# EAGLE board LAUNCHXL-F28069_B_1400922 (EAGLE 6.5.0), part 1 of 2
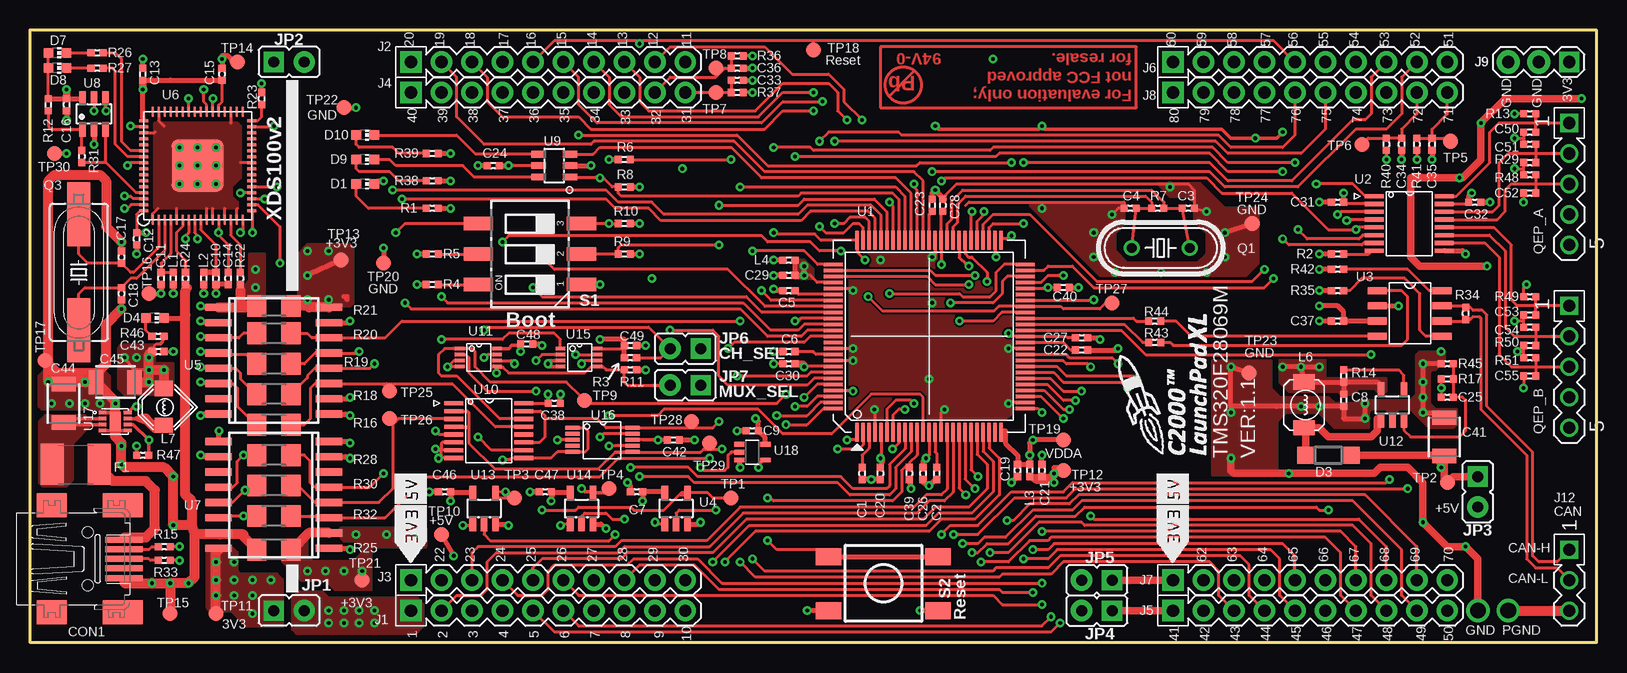
[diagram p7: board, top side]
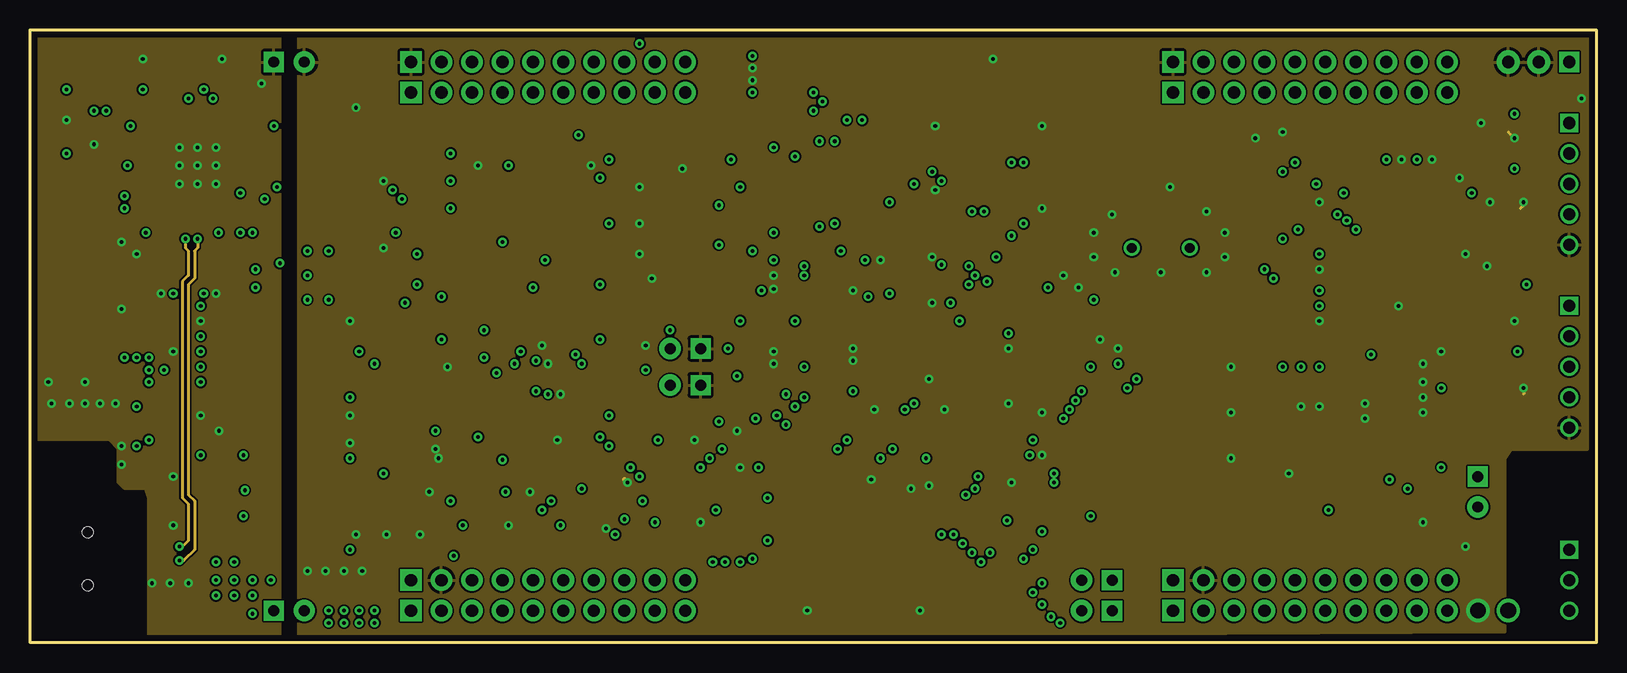
[diagram p8: board, inner layer GND]
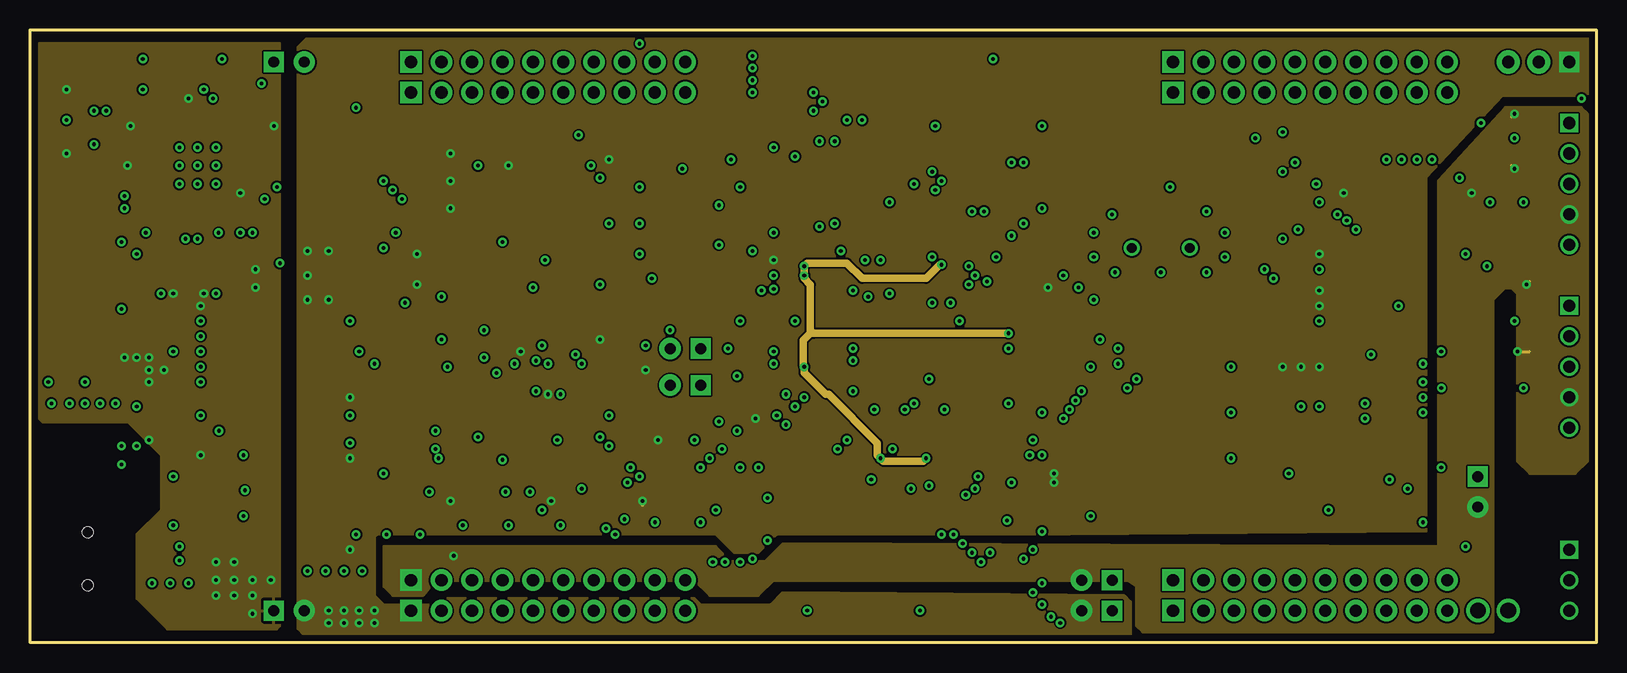
[diagram p9: board, inner layer VDD]
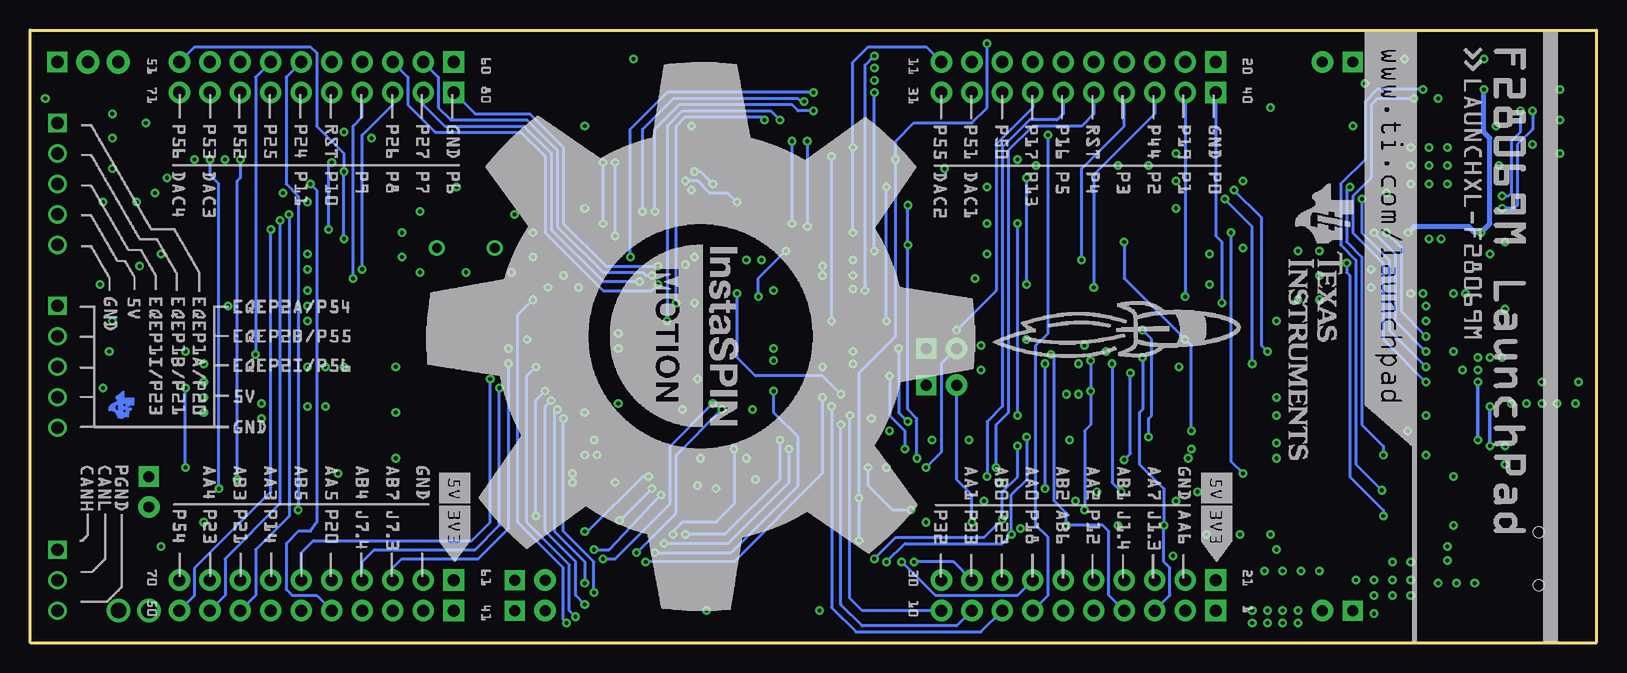
[diagram p10: board, bottom side, seen from below]

Size 130.56 x 51.05 mm. Coordinates in mm from the lower left corner, seen from the top.
Outline: 130.56,0 0,0 0,51.05 130.56,51.05 130.56,0
Copper layers (1*2+3*16): Top 0.035mm / dielectric 0.3mm / GND 0.035mm / dielectric 0.8mm / VDD 0.035mm / dielectric 0.3mm / Bottom 0.035mm
Design rules "default": minimum track width 8mil, minimum drill 10mil, track to track 6mil, track to pad 6mil, pad to pad 5mil, via to via 8mil, smd to smd 5mil, copper to edge 20mil, drill to drill 10mil, minimum pad ring 10mil, minimum via ring 8mil, stop-mask expansion 4mil, vias tented up to drill 0mil, thermal gap 10mil
Net classes: 0 default: width 0.152 mm, drill 0.305 mm, clearance 0.152 mm
bRestrict: area 21.8,38.7 to 24.4,41.3

## Footprints (pad centres in the part's own frame; a part is rotated, then mirrored left to right if it is on the bottom)
C0402 = smd 0.6 x 0.6: 1 -0.5,0; 2 0.5,0
SPARKFUN_1210 = smd 1.2 x 2: 1 -1.6,0; 2 1.6,0
32005-201 = smd 3.1 x 0.5: 1 3,1.6; 2 3,0.8; 3 3,0; 4 3,-0.8; 5 3,-1.6 | smd 2.5 x 2: M1 -3,-4.45; M2 -3,4.45 | smd 3.3 x 2: M3 2.9,4.45; M4 2.9,-4.45 | hole 0.9: 0,2.2; 0,-2.2
CHIP-LED0603 = smd 0.8 x 0.8: A 0,-0.75; C 0,0.75
SOD123 = smd 1.4 x 1.4: A 1.9,0; C -1.9,0
L1812 = smd 1.9 x 3.4: 1 -1.95,0; 2 1.95,0
MA10-1 = drill 1.016 pad 1.778 square: 1 -11.43,0 | drill 1.016 pad 1.778: 2 -8.89,0; 3 -6.35,0; 4 -3.81,0; 5 -1.27,0; 6 1.27,0; 7 3.81,0; 8 6.35,0; 9 8.89,0; 10 11.43,0
CON-LSTB_MA03-1 = drill 1.016 pad 1.676 square: 1 -2.54,0 | drill 1.016 pad 1.93: 2 0,0; 3 2.54,0
MA03-1 = drill 1.016 square: 1 -2.54,0 | drill 1.016: 2 0,0; 3 2.54,0
JP1 = drill 0.914 pad 1.676 square: 1 0,-1.27 | drill 0.914 pad 1.778: 2 0,1.27
R0402 = smd 0.6 x 0.6: 1 -0.5,0; 2 0.5,0
INDUCT-3_7*3_5 = smd 1.27 x 1.8: P$1 0,0; P$2 3.81,0
INDUCT-3.2*3.2 = smd 1.5 x 1.27 rotated 135: P$1 1.019,1.189 | smd 1.5 x 1.27 rotated 315: P$2 -1.137,-0.966
HC49/S = drill 0.813: 1 -2.413,0; 2 2.413,0
HC49UP = smd 5.334 x 1.93: 1 -4.826,0; 2 4.826,0
MA05-1 = drill 1.016 square: 1 -5.08,0 | drill 1.016: 2 -2.54,0; 3 0,0; 4 2.54,0; 5 5.08,0
R1206 = smd 1.6 x 1.803: 1 -1.422,0; 2 1.422,0
CTS-219-03 = smd 1.13 x 2.44: 1 -2.54,-4.3; 2 0,-4.3; 3 2.54,-4.3; 4 2.54,4.3; 5 0,4.3; 6 -2.54,4.3
FSMJSMA = smd 1.397 x 2.108: P$1 0,0; P$2 0,-9.119; P$3 4.496,0; P$4 4.496,-9.119
TESTPAD_B1,27 = smd 1.27 x 1.27: TP 0,0
PQFP100 = smd 1.6 x 0.3: 1 -8,6; 2 -8,5.5; 3 -8,5; 4 -8,4.5; 5 -8,4; 6 -8,3.5; 7 -8,3; 8 -8,2.5; 9 -8,2; 10 -8,1.5; 11 -8,1; 12 -8,0.5; 13 -8,0; 14 -8,-0.5; 15 -8,-1; 16 -8,-1.5; 17 -8,-2; 18 -8,-2.5; 19 -8,-3; 20 -8,-3.5; 21 -8,-4; 22 -8,-4.5; 23 -8,-5; 24 -8,-5.5; 25 -8,-6; 51 8,-6; 52 8,-5.5; 53 8,-5; 54 8,-4.5; 55 8,-4; 56 8,-3.5; 57 8,-3; 58 8,-2.5; 59 8,-2; 60 8,-1.5; 61 8,-1; 62 8,-0.5; 63 8,0; 64 8,0.5; 65 8,1; 66 8,1.5; 67 8,2; 68 8,2.5; 69 8,3; 70 8,3.5; 71 8,4; 72 8,4.5; 73 8,5; 74 8,5.5; 75 8,6 | smd 0.3 x 1.6: 26 -6,-8; 27 -5.5,-8; 28 -5,-8; 29 -4.5,-8; 30 -4,-8; 31 -3.5,-8; 32 -3,-8; 33 -2.5,-8; 34 -2,-8; 35 -1.5,-8; 36 -1,-8; 37 -0.5,-8; 38 0,-8; 39 0.5,-8; 40 1,-8; 41 1.5,-8; 42 2,-8; 43 2.5,-8; 44 3,-8; 45 3.5,-8; 46 4,-8; 47 4.5,-8; 48 5,-8; 49 5.5,-8; 50 6,-8; 76 6,8; 77 5.5,8; 78 5,8; 79 4.5,8; 80 4,8; 81 3.5,8; 82 3,8; 83 2.5,8; 84 2,8; 85 1.5,8; 86 1,8; 87 0.5,8; 88 0,8; 89 -0.5,8; 90 -1,8; 91 -1.5,8; 92 -2,8; 93 -2.5,8; 94 -3,8; 95 -3.5,8; 96 -4,8; 97 -4.5,8; 98 -5,8; 99 -5.5,8; 100 -6,8
TSSOP16-PW = smd 0.35 x 1.6: P$1 0,0; P$2 0.65,0; P$3 1.3,0; P$4 1.95,0; P$5 2.6,0; P$6 3.25,0; P$7 3.9,0; P$8 4.55,0; P$9 4.55,5.85; P$10 3.9,5.85; P$11 3.25,5.85; P$12 2.6,5.85; P$13 1.95,5.85; P$14 1.3,5.85; P$15 0.65,5.85; P$16 0,5.85
SOIC8-PDSO = smd 0.6 x 1.6: P$1 0,0; P$2 1.27,0; P$3 2.54,0; P$4 3.81,0; P$5 3.81,5.4; P$6 2.54,5.4; P$7 1.27,5.4; P$8 0,5.4
SOT23-5-DBV = smd 0.55 x 1.2: 1 -1.204,-0.919; 2 -0.254,-0.919; 3 0.696,-0.919; 4 0.696,1.681; 5 -1.204,1.681
SO-16DW = smd 0.6 x 2.2: 1 -4.445,-4.6; 2 -3.175,-4.6; 3 -1.905,-4.6; 4 -0.635,-4.6; 5 0.635,-4.6; 6 1.905,-4.6; 7 3.175,-4.6; 8 4.445,-4.6; 9 4.445,4.6; 10 3.175,4.6; 11 1.905,4.6; 12 0.635,4.6; 13 -0.635,4.6; 14 -1.905,4.6; 15 -3.175,4.6; 16 -4.445,4.6
QFN64 = smd 0.8 x 0.25: P$1 -4.5,3.75; P$2 -4.5,3.25; P$3 -4.5,2.75; P$4 -4.5,2.25; P$5 -4.5,1.75; P$6 -4.5,1.25; P$7 -4.5,0.75; P$8 -4.5,0.25; P$9 -4.5,-0.25; P$10 -4.5,-0.75; P$11 -4.5,-1.25; P$12 -4.5,-1.75; P$13 -4.5,-2.25; P$14 -4.5,-2.75; P$15 -4.5,-3.25; P$16 -4.5,-3.75; P$33 4.5,-3.75; P$34 4.5,-3.25; P$35 4.5,-2.75; P$36 4.5,-2.25; P$37 4.5,-1.75; P$38 4.5,-1.25; P$39 4.5,-0.75; P$40 4.5,-0.25; P$41 4.5,0.25; P$42 4.5,0.75; P$43 4.5,1.25; P$44 4.5,1.75; P$45 4.5,2.25; P$46 4.5,2.75; P$47 4.5,3.25; P$48 4.5,3.75 | smd 0.25 x 0.8: P$17 -3.75,-4.5; P$18 -3.25,-4.5; P$19 -2.75,-4.5; P$20 -2.25,-4.5; P$21 -1.75,-4.5; P$22 -1.25,-4.5; P$23 -0.75,-4.5; P$24 -0.25,-4.5; P$25 0.25,-4.5; P$26 0.75,-4.5; P$27 1.25,-4.5; P$28 1.75,-4.5; P$29 2.25,-4.5; P$30 2.75,-4.5; P$31 3.25,-4.5; P$32 3.75,-4.5; P$49 3.75,4.5; P$50 3.25,4.5; P$51 2.75,4.5; P$52 2.25,4.5; P$53 1.75,4.5; P$54 1.25,4.5; P$55 0.75,4.5; P$56 0.25,4.5; P$57 -0.25,4.5; P$58 -0.75,4.5; P$59 -1.25,4.5; P$60 -1.75,4.5; P$61 -2.25,4.5; P$62 -2.75,4.5; P$63 -3.25,4.5; P$64 -3.75,4.5 | smd 4.35 x 4.35: TH 0,0
SOT23-6 = smd 0.55 x 1.2: 1 -0.95,-1.3; 2 0,-1.3; 3 0.95,-1.3; 4 0.95,1.3; 5 0,1.3; 6 -0.95,1.3
SOT23-6-DBV = smd 0.55 x 1.2: 1 -0.95,-1.3; 2 0,-1.3; 3 0.95,-1.3; 4 0.95,1.3; 5 0,1.3; 6 -0.95,1.3
TI-DCU8 = smd 0.3 x 0.8: P$1 0,0; P$2 0.5,0; P$3 1,0; P$4 1.5,0; P$5 1.5,3.1; P$6 1,3.1; P$7 0.5,3.1; P$8 0,3.1
TI-DGS10 = smd 0.3 x 1.2: P$1 0,0; P$2 0.5,0; P$3 1,0; P$4 1.5,0; P$5 2,0; P$6 2,5; P$7 1.5,5; P$8 1,5; P$9 0.5,5; P$10 0,5
TI_DSG8 = smd 0.27 x 0.635: P$1 0,-0.05; P$2 0.5,-0.05; P$3 1,-0.05; P$4 1.5,-0.05; P$5 1.5,2.05; P$6 1,2.05; P$7 0.5,2.05; P$8 0,2.05 | smd 1.6 x 0.9: P$9 0.75,1
74XX-LITTLE-DE_SC70-5 = smd 0.4 x 0.85: 1 -0.65,-1.1; 2 0,-1.1; 3 0.65,-1.1; 4 0.65,1.1; 5 -0.65,1.1

## Placement (x,y rotation side)
C1  2.2u  [C0402]  69.34,14.1 270 top
C2  2.2u  [C0402]  75.56,14.1 270 top
C3  36p  [C0402]  96.52,36.2 0 top
C4  36p  [C0402]  91.69,36.2 180 top
C5  2.2u  [C0402]  63.25,29.34 180 top
C6  2.2u  [C0402]  63.25,24.26 180 top
C7  0.1u  [C0402]  50.55,12.57 180 top
C8  4.7u  [C0402]  109.47,20.19 270 top
C9  0.1u  [C0402]  60.2,17.65 180 top
C10  4.7u  [C0402]  15.49,30.35 270 top
C11  4.7u  [C0402]  10.92,30.35 270 top
C12  0.1u  [C0402]  8.89,33.66 270 top
C13  0.1u  [C0402]  9.4,47.37 90 top
C14  0.1u  [C0402]  16.51,30.35 270 top
C15  3.3u  [C0402]  16,47.37 90 top
C16  0.1u  [C0402]  3.05,44.83 270 top
C17  36p  [C0402]  7.62,32.13 90 top
C18  36p  [C0402]  7.62,29.08 270 top
C19  2.2u  [C0402]  82.3,14.35 270 top
C20  2.2u  [C0402]  70.87,14.1 270 top
C21  2.2u  [C0402]  84.33,14.35 90 top
C22  2.2u  [C0402]  87.63,24.38 0 top
C23  2.2u  [C0402]  75.18,36.45 90 top
C24  0.1u  [C0402]  38.61,39.75 180 top
C25  820p  [C0402]  118.11,20.45 0 top
C26  2.2u  [C0402]  74.42,14.1 270 top
C27  2.2u  [C0402]  87.63,25.4 0 top
C28  2.2u  [C0402]  76.07,36.45 90 top
C29  2.2u  [C0402]  63.25,30.61 180 top
C30  2.2u  [C0402]  63.25,23.24 180 top
C31  0.1u  [C0402]  108.97,36.7 180 top
C32  0.1u  [C0402]  120.4,36.7 0 top
C33  0.1u  [C0402]  58.93,46.86 0 top
C34  0.1u  [C0402]  114.3,41.53 270 top
C35  0.1u  [C0402]  116.84,41.53 270 top
C36  0.1u  [C0402]  58.93,47.88 0 top
C37  0.1u  [C0402]  108.97,26.8 180 top
C38  0.1u  [C0402]  43.69,19.94 0 top
C39  0.1u  [C0402]  73.28,14.1 270 top
C40  0.1u  [C0402]  86.11,29.59 0 top
C41  10uF  [SPARKFUN_1210]  117.86,17.14 270 top
C42  0.1u  [C0402]  53.59,16.89 0 top
C43  0.1u  [C0402]  10.67,24.26 0 top
C44  10uF  [SPARKFUN_1210]  2.79,19.94 270 top
C45  22uF  [SPARKFUN_1210]  7.11,21.72 0 top
C46  0.1u  [C0402]  34.54,12.57 180 top
C47  0.1u  [C0402]  42.93,12.57 180 top
C48  0.1u  [C0402]  41.4,24.89 0 top
C49  0.1u  [C0402]  50.04,24.77 0 top
C50  0.001u  [C0402]  124.97,42.55 180 top
C51  0.001u  [C0402]  124.97,41.53 180 top
C52  0.001u  [C0402]  124.97,37.47 180 top
C53  0.001u  [C0402]  124.97,27.3 180 top
C54  0.001u  [C0402]  124.97,26.29 180 top
C55  0.001u  [C0402]  124.97,22.22 180 top
CON1  UBC05V128-B0C04D  [32005-201]  4.83,6.98 0 top
D1  [CHIP-LED0603]  27.94,38.23 270 top
D3  1N5819HW-7-F  [SOD123]  108.2,15.62 180 top
D4  [CHIP-LED0603]  10.41,27.05 270 top
D7  [CHIP-LED0603]  2.29,49.15 270 top
D8  [CHIP-LED0603]  2.29,47.88 270 top
D9  [CHIP-LED0603]  27.94,40.26 270 top
D10  [CHIP-LED0603]  27.94,42.29 270 top
E$1  [IS_MOTION]  51.82,2.67 0 top
E$2  [F28069M_BACKSILK_1]  -0.25,0.13 0 top
E$3  [F28069M_BACKSILK_2]  26.42,0.13 0 top
E$4  [F28069M_BACKSILK_3]  90.55,0.25 0 top
E$5  [POWER_TAG_FRONT]  29.97,6.48 0 top
E$6  [POWER_TAG_FRONT]  93.47,6.48 0 top
E$7  [POWERTAG_BACK]  30.1,6.6 0 top
E$8  [POWERTAG_BACK]  93.6,6.6 0 top
E$9  [ROCKET_1]  27.69,21.21 0 top
F1  500mA  [L1812]  3.81,14.86 0 top
J1  [MA10-1]  43.18,2.67 0 top
J2  [MA10-1]  43.18,48.39 0 top
J3  [MA10-1]  43.18,5.21 0 top
J4  [MA10-1]  43.18,45.85 0 top
J5  [MA10-1]  106.68,2.67 0 top
J6  [MA10-1]  106.68,48.39 0 top
J7  [MA10-1]  106.68,5.21 0 top
J8  [MA10-1]  106.68,45.85 0 top
J9  [CON-LSTB_MA03-1]  125.73,48.39 180 top
J12  [MA03-1]  128.27,5.21 270 top
JP1  [JP1]  21.59,2.67 270 top
JP2  [JP1]  21.59,48.39 270 top
JP3  [JP1]  120.65,12.57 180 top
JP4  [JP1]  88.9,2.67 90 top
JP5  [JP1]  88.9,5.21 90 top
JP6  [JP1]  54.61,24.51 90 top
JP7  [JP1]  54.61,21.46 90 top
L1  BLM15AG601SN1D  [R0402]  11.94,30.35 90 top
L2  BLM15AG601SN1D  [R0402]  14.48,30.35 90 top
L3  BKP1005HS221-T  [R0402]  83.31,14.35 270 top
L4  BLM15PD600SN1D  [R0402]  63.25,31.88 180 top
L6  3.3uH  [INDUCT-3_7*3_5]  106.17,21.72 270 top
L7  2.2uH  [INDUCT-3.2*3.2]  11.25,19.61 45 top
Q1  [HC49/S]  94.23,32.89 0 top
Q3  12M  [HC49UP]  4.06,30.86 270 top
QEP_A  [MA05-1]  128.27,38.23 270 top
QEP_B  [MA05-1]  128.27,22.99 270 top
R1  820  [R0402]  33.53,36.2 0 top
R2  2.2k  [R0402]  108.97,32.39 0 top
R3  10K  [R0402]  50.04,23.75 0 top
R4  820  [R0402]  33.53,29.84 180 top
R5  820  [R0402]  33.53,32.39 180 top
R6  2.2k  [R0402]  49.53,40.26 180 top
R7  1M  [R0402]  93.98,36.2 0 top
R8  2.2k  [R0402]  49.53,37.97 180 top
R9  2.2k  [R0402]  49.53,32.39 180 top
R10  2.2k  [R0402]  49.53,34.93 180 top
R11  10K  [R0402]  50.04,22.73 180 top
R12  10K  [R0402]  1.52,44.83 270 top
R13  1K  [R0402]  124.97,44.07 0 top
R14  10K  [R0402]  109.47,22.22 90 top
R15  0R  [R0402]  11.18,8 0 top
R16  0  [R1206]  20.32,18.16 0 top
R17  30.1K  [R0402]  118.11,21.97 0 top
R18  0  [R1206]  20.32,20.7 0 top
R19  0  [R1206]  20.32,23.24 0 top
R20  0  [R1206]  20.32,25.78 0 top
R21  0  [R1206]  20.32,28.07 0 top
R22  1K  [R0402]  17.53,30.35 90 top
R23  1K  [R0402]  19.3,45.34 90 top
R24  12k  [R0402]  12.95,30.35 90 top
R25  0  [R1206]  20.32,7.75 0 top
R26  330  [R0402]  5.59,49.15 180 top
R27  330  [R0402]  5.59,47.88 180 top
R28  0  [R1206]  20.32,15.62 0 top
R29  1K  [R0402]  124.97,40.01 0 top
R30  0  [R1206]  20.32,13.08 0 top
R31  2.2k  [R0402]  4.32,40.51 270 top
R32  0  [R1206]  20.32,10.54 0 top
R33  0R  [R0402]  11.18,6.86 0 top
R34  120  [R0402]  119.63,27.43 90 top
R35  10K  [R0402]  108.97,29.34 180 top
R36  1K  [R0402]  58.93,48.9 180 top
R37  1K  [R0402]  58.93,45.85 180 top
R38  330  [R0402]  33.53,38.48 0 top
R39  330  [R0402]  33.53,40.77 0 top
R40  1K  [R0402]  113.03,41.53 90 top
R41  1K  [R0402]  115.57,41.53 90 top
R42  10K  [R0402]  108.97,31.11 180 top
R43  0R  [R0402]  93.73,25.02 180 top
R44  0R  [R0402]  93.73,26.8 180 top
R45  10K  [R0402]  118.11,23.24 180 top
R46  820  [R0402]  10.67,25.53 0 top
R47  100K  [R0402]  9.4,15.62 180 top
R48  1K  [R0402]  124.97,38.99 0 top
R49  1K  [R0402]  124.97,28.83 0 top
R50  1K  [R0402]  124.97,24.77 0 top
R51  1K  [R0402]  124.97,23.75 0 top
S1  204-3ST  [CTS-219-03]  41.66,32.39 90 top
S2  TP-1138K9-BE1125  [FSMJSMA]  66.55,2.67 90 top
TP1  TESTPAD_TPB1,27  [TESTPAD_B1,27]  58.42,12.07 0 top
TP2  TESTPAD_TPB1,27  [TESTPAD_B1,27]  118.11,13.34 0 top
TP3  TESTPAD_TPB1,27  [TESTPAD_B1,27]  40.39,12.07 0 top
TP4  TESTPAD_TPB1,27  [TESTPAD_B1,27]  48.26,12.83 0 top
TP5  TESTPAD_TPB1,27  [TESTPAD_B1,27]  118.36,41.78 0 top
TP6  TESTPAD_TPB1,27  [TESTPAD_B1,27]  111,41.53 0 top
TP7  TESTPAD_TPB1,27  [TESTPAD_B1,27]  57.15,45.85 0 top
TP8  TESTPAD_TPB1,27  [TESTPAD_B1,27]  57.15,47.88 0 top
TP9  TESTPAD_TPB1,27  [TESTPAD_B1,27]  46.23,20.19 0 top
TP10  TESTPAD_TPB1,27  [TESTPAD_B1,27]  34.29,9.02 0 top
TP11  TESTPAD_TPB1,27  [TESTPAD_B1,27]  15.49,2.41 0 top
TP12  TESTPAD_TPB1,27  [TESTPAD_B1,27]  86.11,14.35 270 top
TP13  TESTPAD_TPB1,27  [TESTPAD_B1,27]  25.91,31.88 0 top
TP14  TESTPAD_TPB1,27  [TESTPAD_B1,27]  17.27,48.39 0 top
TP15  TESTPAD_TPB1,27  [TESTPAD_B1,27]  11.68,2.41 0 top
TP16  TESTPAD_TPB1,27  [TESTPAD_B1,27]  9.91,29.08 0 top
TP17  TESTPAD_TPB1,27  [TESTPAD_B1,27]  1.27,23.49 0 top
TP18  TESTPAD_TPB1,27  [TESTPAD_B1,27]  65.28,49.4 270 top
TP19  TESTPAD_TPB1,27  [TESTPAD_B1,27]  86.11,16.89 0 top
TP20  TESTPAD_TPB1,27  [TESTPAD_B1,27]  29.46,31.62 0 top
TP21  TESTPAD_TPB1,27  [TESTPAD_B1,27]  27.69,5.21 0 top
TP22  TESTPAD_TPB1,27  [TESTPAD_B1,27]  26.16,44.58 270 top
TP23  TESTPAD_TPB1,27  [TESTPAD_B1,27]  101.6,22.48 0 top
TP24  TESTPAD_TPB1,27  [TESTPAD_B1,27]  101.85,34.93 0 top
TP25  TESTPAD_TPB1,27  [TESTPAD_B1,27]  29.97,20.95 0 top
TP26  TESTPAD_TPB1,27  [TESTPAD_B1,27]  29.97,18.67 0 top
TP27  TESTPAD_TPB1,27  [TESTPAD_B1,27]  90.17,28.32 0 top
TP28  TESTPAD_TPB1,27  [TESTPAD_B1,27]  55.12,18.41 270 top
TP29  TESTPAD_TPB1,27  [TESTPAD_B1,27]  56.64,16.64 270 top
TP30  TESTPAD_TPB1,27  [TESTPAD_B1,27]  2.03,40.77 0 top
U1  TMS320F28069MPZT  [PQFP100]  74.93,25.53 90 top
U2  TXB0106PWR  [TSSOP16-PW]  112.01,37.21 270 top
U3  SN65HVD234D  [SOIC8-PDSO]  112.27,29.34 270 top
U4  SN74AHC1G02DBVR  [SOT23-5-DBV]  54.1,10.79 0 top
U5  ISO7240  [SO-16DW]  20.32,23.49 270 top
U6  FT2232H  [QFN64]  13.97,39.75 90 top
U7  ISO7231  [SO-16DW]  20.32,12.32 90 top
U8  93LC56BT-I/OT  [SOT23-6]  5.33,44.07 0 top
U9  SN74LVC2G07  [SOT23-6-DBV]  43.69,39.75 90 top
U10  SN74LV4052APW  [TSSOP16-PW]  35.31,19.94 270 top
U11  TS5A3153DCUR  [TI-DCU8]  35.81,24.51 270 top
U12  LMR62421XMFE/NOPB  [SOT23-5-DBV]  113.79,19.43 0 top
U13  SN74AHC1G32  [SOT23-5-DBV]  38.1,10.79 0 top
U14  SN74AHC1G32  [SOT23-5-DBV]  46.23,10.79 0 top
U15  TS5A3153DCUR  [TI-DCU8]  44.2,24.51 270 top
U16  TS5A23159DGSR  [TI-DGS10]  45.21,17.91 270 top
U17  TPS62162DSGR  [TI_DSG8]  6.1,19.18 270 top
U18  SN74LVC1G04DCKR  [74XX-LITTLE-DE_SC70-5]  60.2,15.88 270 top
U$1  ROY_JUMPER  [ROY_JUMPER]  60.45,57.53 0 top  (outside the outline)
U$2  ROY_JUMPER  [ROY_JUMPER]  58.17,57.53 0 top  (outside the outline)
U$3  [MSP430_LAB_TILOGO_SMALL]  122.68,19.68 270 bottom
U$4  [TRADEMARK]  95.5,21.46 90 top
U$5  [STI_LOGO_ROCKET]  94.49,15.62 90 top
U$6  [STI_LOGO_LAUNCHPADC2K]  98.04,15.62 90 top
U$7  [XL]  98.04,25.02 90 top
U$8  [MSP430_LAB_TILOGO_SMALL_TSTOP]  122.68,19.68 270 bottom
U$9  ROY_JUMPER  [ROY_JUMPER]  62.74,57.53 0 top  (outside the outline)
U$10  ROY_JUMPER  [ROY_JUMPER]  65.02,57.53 0 top  (outside the outline)
U$11  ROY_JUMPER  [ROY_JUMPER]  67.31,57.53 0 top  (outside the outline)
U$12  ROY_JUMPER  [ROY_JUMPER]  69.6,57.53 0 top  (outside the outline)
U$13  ROY_JUMPER  [ROY_JUMPER]  72.14,57.53 0 top  (outside the outline)